# EAGLE design MotorShield (EAGLE 7.5.0)
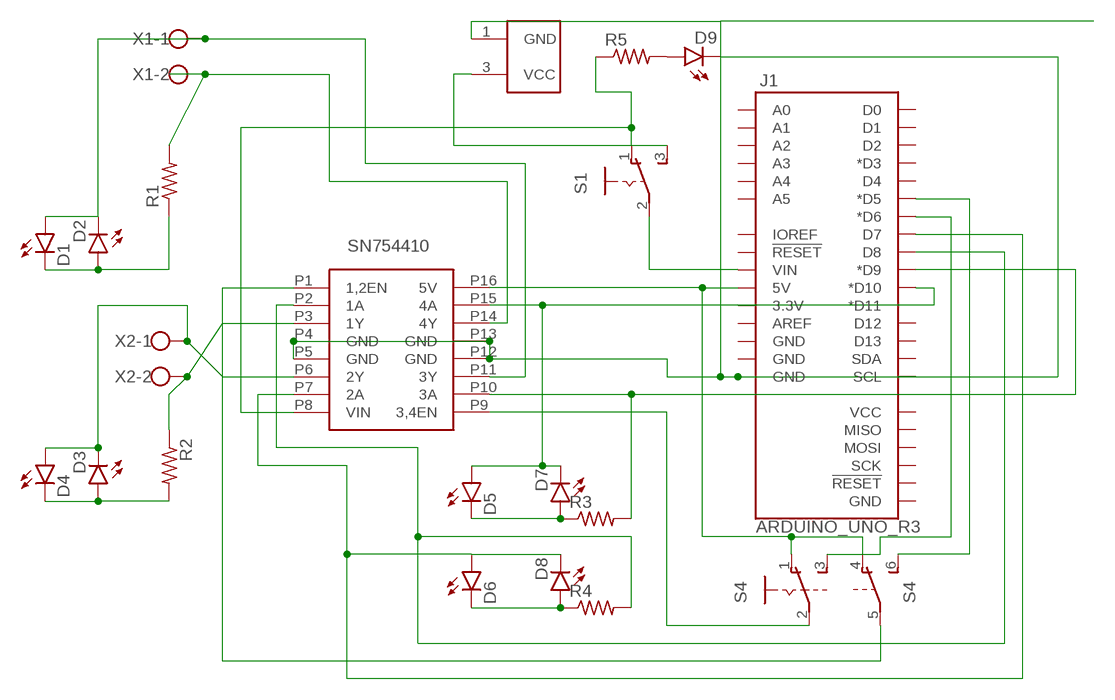
[diagram p0: schematic, sheet 1]

## Parts
D1  LED3MM  [LED3MM]
D2  LED3MM  [LED3MM]
D3  LED3MM  [LED3MM]
D4  LED3MM  [LED3MM]
D5  LED3MM  [LED3MM]
D6  LED3MM  [LED3MM]
D7  LED3MM  [LED3MM]
D8  LED3MM  [LED3MM]
D9  LED3MM  [LED3MM]
J1  ARDUINO_UNO_R3  [ARDUINO_R3]
R1  RESISTOR0204/7  [0204/7]
R2  RESISTOR0204/7  [0204/7]
R3  RESISTOR0204/7  [0204/7]
R4  RESISTOR0204/7  [0204/7]
R5  RESISTOR0204/7  [0204/7]
S1  SLIDE_SWITCH  [SLIDE_SWITCH]
S4  DUAL_SLIDE_SWITCH  [DUAL_SLIDE_SWITCH]
U$1  MOTOR_DRIVERDIP16  [DIP16]
U$2  BARREL_CONNECTOR  [5.5-2.5-BARRELCONNECTOR]
X1  SCREWCONNECTOR  [2PIN-SCREW-TERMINAL]
X2  SCREWCONNECTOR  [2PIN-SCREW-TERMINAL]

## Nets
N$1: R2.1 U$1.P3(1Y) X2.2
N$3: R1.2 U$1.P14(4Y) X1.2
N$4: J1.VIN S1.2(P)
N$5: D6.A D8.K(C) J1.D7 U$1.P7(2A)
N$6: R5.1 S1.1(O) U$1.P8(VIN)
N$8: D5.A D7.K(C) J1.D10(*D10) U$1.P15(4A)
N$9: S4.2(A:P) U$1.P9(3,4EN)
N$10: D3.K(C) D4.A U$1.P6(2Y) X2.1
N$11: J1.D8 R4.2 U$1.P2(1A)
N$12: J1.D9(*D9) R3.2 U$1.P10(3A)
N$13: D9.A R5.2
N$14: J1.D5(*D5) S4.6(B:S)
N$15: S4.5(B:P) U$1.P1(1,2EN)
N$16: J1.D6(*D6) S4.3(A:S)
N$18: D3.A D4.K(C) R2.2
N$19: D5.K(C) D7.A R3.1
N$20: D1.A D2.K(C) U$1.P11(3Y) X1.1
N$21: D1.K(C) D2.A R1.1
N$22: J1.5V S4.1(A:O) S4.4(B:O) U$1.P16(5V)
N$23: D9.K(C) J1.GND@2(GND) U$1.P4(GND) U$1.P5(GND) U$1.P12(GND) U$1.P13(GND) U$2.1(GND)
N$24: D6.K(C) D8.A R4.1
N$26: S1.3(S) U$2.3(VCC)
Unconnected: J1.3.3V J1.A0 J1.A1 J1.A2 J1.A3 J1.A4 J1.A5 J1.AREF J1.D0 J1.D1 J1.D2 J1.D3(*D3) J1.D4 J1.D11(*D11) J1.D12 J1.D13 J1.GND@1(GND) J1.GND@3(GND) J1.GND@4(GND) J1.IOREF J1.MISO J1.MOSI J1.RESET@1(!RESET!) J1.RESET@2(!RESET!) J1.SCK J1.SCL J1.SDA J1.VCC

## Library data of the parts
D1-D9 = ISCTRainingProgram:LED: LEDs Standard schematic elements and footprints for 5mm, 3mm, 1206, and 0603 sized LEDs. 5mm - Spark Fun Electronics SKU : COM-00529 (and others); PROD_ID: DIO-08794
J1 = ISCTRainingProgram:ARDUINO_UNO_R3: Arduino R3 Footprint (w/ SPI header)
R1-R5 = ISCTRainingProgram:RESISTOR: RESISTOR, American symbol
S1 = ISCTRainingProgram:SLIDE_SWITCH: SLIDING SWITCH Distributor Buerklin, 11G810
S4 = ISCTRainingProgram:DUAL_SLIDE_SWITCH: SLIDING SWITCH Siemens, distributor Buerklin, 11G766
U$1 = ISCTRainingProgram:MOTOR_DRIVER: The SN754410 is a quadruple high-current half-H driver designed to provide bidirectional drive currents up to 1 A at voltages from 4.5 V to 36 V. The device is designed to drive inductive loads such as relays, solenoids, DC and bipolar stepping motors, as well as other high-current/high-voltage loads in positive-supply applications.
U$2 = ISCTRainingProgram:BARREL_CONNECTOR: barrel connector for power input
X1 X2 = ISCTRainingProgram:SCREWCONNECTOR: WAGO SCREW CLAMP; MPN: 237-102; OC_FARNELL: unknown; OC_NEWARK: 70K9898

## Board
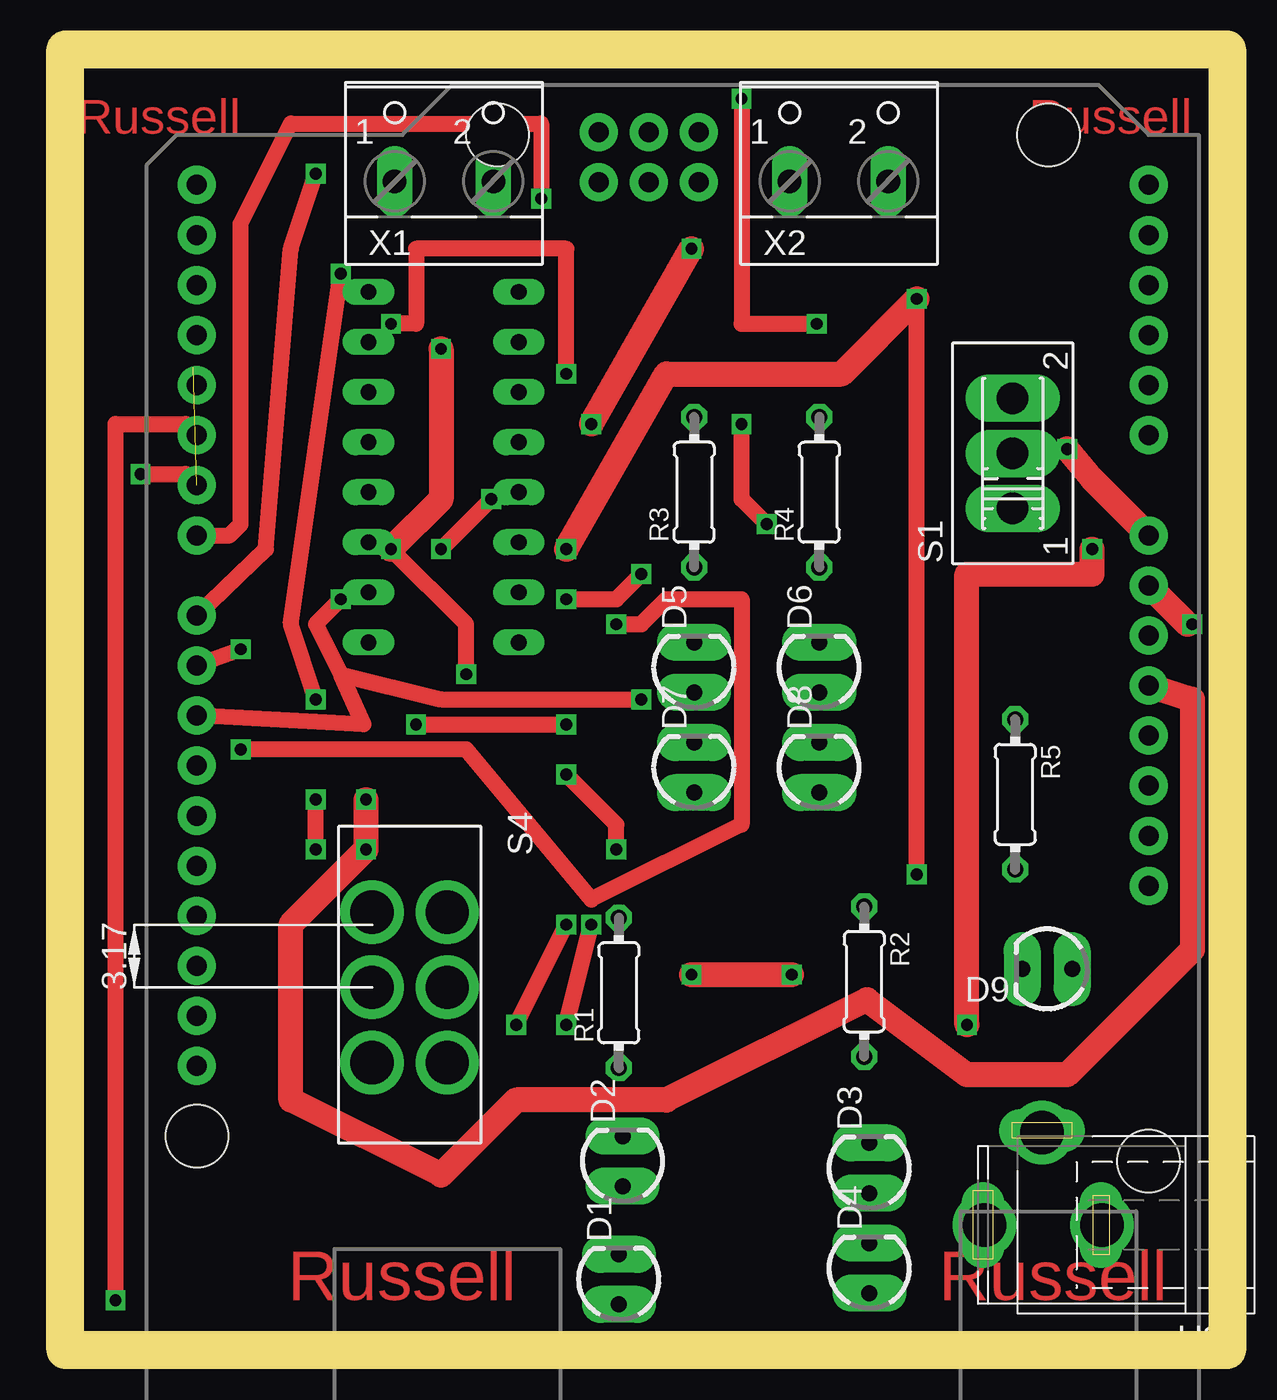
[diagram p1: board, top side]
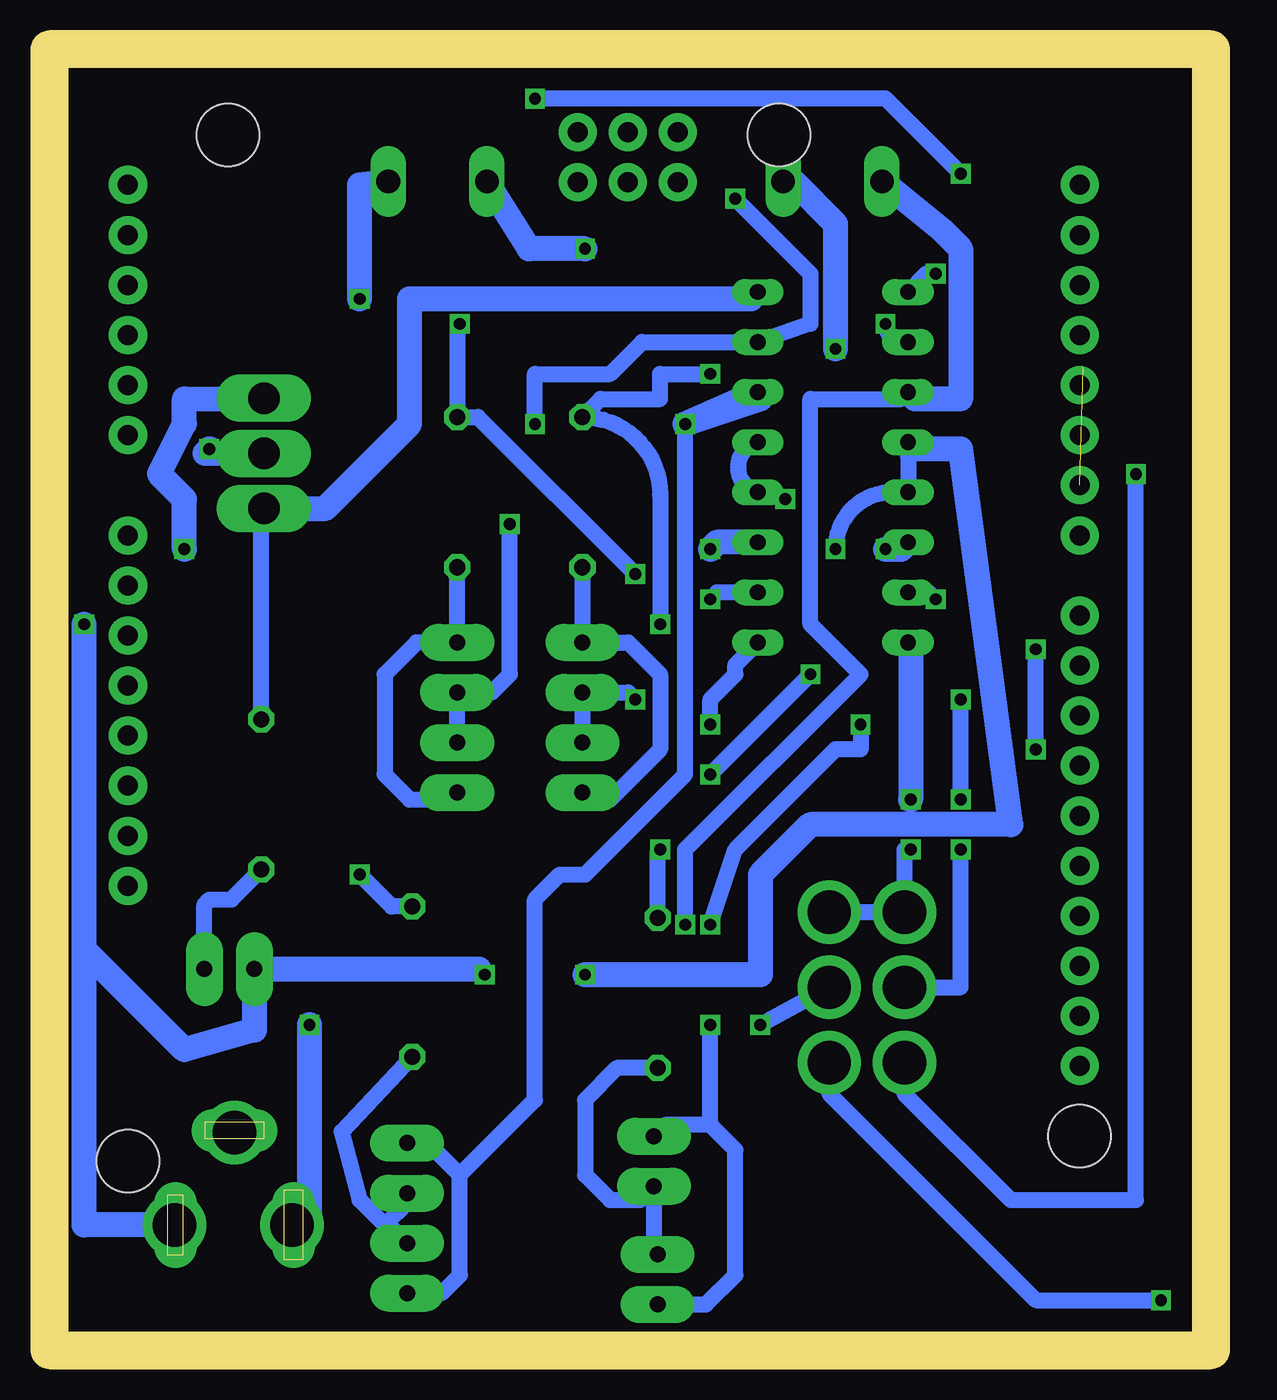
[diagram p2: board, bottom side, seen from below]

Size 58.92 x 66 mm. Coordinates in mm from the lower left corner, seen from the top.
Outline: 0,0 0,66 58.92,66 58.92,0 0,0
Copper layers (1*16): Top 0.035mm / dielectric 1.5mm / Bottom 0.035mm
Design rules "default": minimum track width 10mil, minimum drill 24mil, track to track 8mil, track to pad 8mil, pad to pad 8mil, via to via 8mil, smd to smd 8mil, copper to edge 40mil, drill to drill 8mil, minimum pad ring 10mil, minimum via ring 8mil, stop-mask expansion 4mil, vias tented up to drill 0mil, thermal gap 10mil

### Footprints (pad centres in the part's own frame; a part is rotated, then mirrored left to right if it is on the bottom)
LED3MM = drill 0.813 pad 1.88 long: A -1.27,0; K 1.27,0
ARDUINO_R3 = drill 1.016 pad 1.93: 3.3V 35.56,2.54; 5V 38.1,2.54; A0 50.8,2.54; A1 53.34,2.54; A2 55.88,2.54; A3 58.42,2.54; A4 60.96,2.54; A5 63.5,2.54; AREF 23.876,50.8; D0 63.5,50.8; D1 60.96,50.8; D2 58.42,50.8; D3 55.88,50.8; D4 53.34,50.8; D5 50.8,50.8; D6 48.26,50.8; D7 45.72,50.8; D8 41.656,50.8; D9 39.116,50.8; D10 36.576,50.8; D11 34.036,50.8; D12 31.496,50.8; D13 28.956,50.8; GND@1 40.64,2.54; GND@2 43.18,2.54; GND@3 26.416,50.8; GND@4 66.18,25.35; IOREF 30.48,2.54; MISO 63.64,30.43; MOSI 66.18,27.89; NC 27.94,2.54; RESET@1 33.02,2.54; RESET@2 63.64,25.35; SCK 63.64,27.89; SCL 18.796,50.8; SDA 21.336,50.8; VCC 66.18,30.43; VIN 45.72,2.54 | hole 3.175: 15.24,50.8; 66.04,35.56; 66.04,7.62; 13.97,2.54
0204/7 = drill 0.813 octagon: 1 -3.81,0; 2 3.81,0
SLIDE_SWITCH = drill 1.6 long: 1 -2.794,0; 2 0,0; 3 2.794,0
DUAL_SLIDE_SWITCH = drill 2.2: 1 -3.81,-1.905; 2 0,-1.905; 3 3.81,-1.905; 4 -3.81,1.905; 5 0,1.905; 6 3.81,1.905
DIP16 = drill 0.8 long: P1 -8.89,-3.81; P2 -6.35,-3.81; P3 -3.81,-3.81; P4 -1.27,-3.81; P5 1.27,-3.81; P6 3.81,-3.81; P7 6.35,-3.81; P8 8.89,-3.81; P9 8.89,3.81; P10 6.35,3.81; P11 3.81,3.81; P12 1.27,3.81; P13 -1.27,3.81; P14 -3.81,3.81; P15 -6.35,3.81; P16 -8.89,3.81
5.5-2.5-BARRELCONNECTOR = drill 0.8 pad 2.184 long: 1 -3,0; 2 0,-4.8 | drill 1 pad 2.184 long: 3 3,0 | drill 2.2: P$1 -3.048,0; P$2 2.921,0; P$3 0,-4.699
2PIN-SCREW-TERMINAL = drill 1.194 long: 1 -2.5,-1.27; 2 2.5,-1.27

### Placement (x,y rotation side)
D1  28.07,3.59 90 top
D2  28.26,9.59 90 top
D3  40.77,9.24 90 top
D4  40.77,4.16 90 top
D5  31.88,34.64 90 top
D6  38.23,34.64 90 top
D7  31.88,29.56 90 top
D8  38.23,29.56 90 top
D9  49.79,19.34 180 top
J1  57.47,-4.38 90 top
R1  28.07,18.13 90 top
R2  40.51,18.7 270 top
R3  31.88,43.53 90 top
R4  38.23,43.53 90 top
R5  48.16,28.2 270 top
S1  48.04,45.5 90 top
S4  17.46,18.41 270 top
U$1  19.18,44.8 90 top
U$2  49.53,6.35 180 top
X1  19.2,60.57 0 top
X2  39.23,60.57 0 top

### Tracks (layer width: path | path; a pad name or v marks a point on that pad's centre or on a via)
N$1  (via drill 0.6)
  Top 0.813: v43.18,24.13 v43.18,53.34
  Top 1.27: v25.4,40.64 30.48,49.53 39.37,49.53 v43.18,53.34
  Bottom 0.813: R2.1 41.56,22.51 v43.18,24.13
  Bottom 1.27: U$1.P3 25.05,40.99 v25.4,40.64 | v43.18,53.34 43.18,59.12 X2.2
N$2  (via drill 0.6)
  other vias: 57.15,36.83
N$3  (via drill 0.6)
  Top 0.813: v27.94,25.4 27.94,26.67 v25.4,29.21 | v20.32,34.29 20.32,36.83 v16.51,40.64
  Top 1.27: v19.05,50.8 19.05,43.18 v16.51,40.64
  Bottom 0.813: R1.2 28.07,25.27 v27.94,25.4 | v25.4,29.21 v20.32,34.29
  Bottom 1.27: X1.2 21.2,59.3 19.05,57.15 v19.05,50.8 | v16.51,40.64 15.72,40.64 U$1.P14
N$4  (via drill 0.6)
  Top 1.27: v50.8,45.72 52.07,44.2 J1.VIN
  Bottom 1.27: S1.2 51.02,45.5 v50.8,45.72
N$5  (via drill 0.6)
  Top 0.813: v35.56,41.91 34.29,43.18 v34.29,46.99 | J1.D7 8.32,41.34 8.89,41.91 8.89,57.15 11.43,62.23 24.13,62.23 v24.13,58.42
  Bottom 0.813: D8.K D6.A 36.48,33.37 35.56,34.29 v35.56,41.91 | v34.29,46.99 34.29,49.53 30.48,49.53 28.86,51.15 U$1.P7 20.32,52.07 20.32,54.61 v24.13,58.42
N$6
  Bottom 0.813: R5.1 48.16,42.59 S1.1
  Bottom 1.27: S1.1 44.92,42.71 40.64,46.99 40.64,53.34 23.34,53.34 U$1.P8
N$7  (via drill 0.6)
  other vias: 27.94,25.4
N$8  (via drill 0.6)
  Top 0.813: v13.97,38.1 12.7,36.83 13.97,34.29 | 13.97,34.29 15.11,31.75 J1.D10 | v29.21,33.02 19.05,33.02 13.97,34.29
  Bottom 0.813: U$1.P15 14.32,38.45 v13.97,38.1 | D7.K D5.A 29.56,33.37 v29.21,33.02
N$9  (via drill 0.6)
  Top 0.813: v12.7,25.4 v12.7,27.94 | v12.7,33.02 11.43,36.83 v13.97,54.61
  Bottom 0.813: S4.2 12.7,18.41 v12.7,25.4 | v12.7,27.94 v12.7,33.02 | v13.97,54.61 14.45,54.61 U$1.P9
N$10  (via drill 0.6)
  Top 1.27: v26.67,46.99 v31.75,55.88
  Bottom 0.813: 38.1,8.89 39.37,10.16 | 39.37,10.16 40.42,10.16 D3.K 39.72,10.51 39.37,10.16 | D4.A 39.02,2.89 38.1,3.81 38.1,8.89 | 38.1,8.89 34.29,12.7 34.29,22.86 33.02,24.13 31.75,24.13 26.67,29.21 v26.67,46.99
  Bottom 1.27: 22.86,48.26 v26.67,46.99 U$1.P6 | v31.75,55.88 34.58,55.88 X2.1
N$11  (via drill 0.6)
  Top 0.813: v25.4,38.1 27.94,38.1 v29.21,39.37 | J1.D8 10.16,40.64 11.43,55.88 v12.7,59.69 | v34.29,63.5 34.29,52.07 v38.1,52.07
  Bottom 0.813: v29.21,39.37 37.18,47.34 R4.2 38.23,51.94 v38.1,52.07 | U$1.P2 25.05,38.45 v25.4,38.1 | v12.7,59.69 16.51,63.5 v34.29,63.5
N$12  (via drill 0.6)
  Top 0.813: v25.4,49.53 25.4,55.88 17.78,55.88 17.78,52.07 v16.51,52.07 | v27.94,36.83 29.21,36.83 30.48,38.1 34.29,38.1 34.29,26.67 26.67,22.86 20.32,30.48 v8.89,30.48 | v8.89,35.56 J1.D9
  Bottom 0.813: v25.4,49.53 27.94,49.53 27.94,48.26 30.96,48.26 R3.2 arc90 27.94,43.4 v27.94,36.83 | v16.51,52.07 arc-90 15.59,51.15 U$1.P10 | v8.89,30.48 v8.89,35.56
N$13
  Bottom 0.813: D9.A 51.06,22.6 50.8,22.86 49.69,22.86 R5.2
N$14  (via drill 0.6)
  Top 0.813: v2.54,2.54 2.54,46.99 6.1,46.99 J1.D5
  Bottom 0.813: S4.6 19.37,13.02 8.89,2.54 v2.54,2.54
N$15  (via drill 0.6)
  Top 0.813: v22.86,16.51 v25.4,21.59 | v17.78,31.75 v25.4,31.75
  Bottom 0.813: S4.5 v22.86,16.51 | v25.4,21.59 24.13,25.4 19.05,30.48 17.78,30.48 v17.78,31.75 | v25.4,31.75 25.4,33.02 24.13,34.29 24.13,34.77 U$1.P1
N$16  (via drill 0.6)  (1 unrouted)
  Top 0.813: v3.81,44.45 6.1,44.45 J1.D6
  Bottom 0.813: S4.3 15.55,13.02 10.16,7.62 3.81,7.62 v3.81,44.45
N$18
  Bottom 0.813: R2.2 44.1,11.08 43.18,7.62 41.91,6.35 | 41.91,6.35 41.69,6.35 D4.K | D3.A 40.77,7.49 41.91,6.35
N$19
  Bottom 0.813: R3.1 D5.K 29.56,35.91 27.94,34.29 27.94,30.48 30.48,27.94 31.53,27.94 D7.A
N$20  (via drill 0.6)
  Top 0.813: v25.4,16.51 v26.67,21.59
  Bottom 0.813: D1.A 25.62,2.32 24.13,3.81 24.13,10.16 25.4,11.43 | 25.4,11.43 27.69,11.43 D2.K | 25.4,11.43 v25.4,16.51 | v26.67,21.59 26.67,25.4 17.78,34.29 20.32,36.83 20.32,48.26 15.72,48.26 U$1.P11 15.02,48.26
  Bottom 1.27: X1.1 13.58,56.76 12.7,55.88 12.7,48.26 15.02,48.26
N$21
  Bottom 0.813: R1.1 30.13,14.32 31.75,12.7 31.75,8.89 30.48,7.62 28.96,7.62 D2.A 28.26,5.05 D1.K
N$22  (via drill 0.6)
  Top 1.27: v15.24,27.94 v15.24,25.4 11.43,21.59 11.43,12.7 19.05,8.89 22.86,12.7 30.48,12.7 40.64,17.78 45.72,13.97 50.8,13.97 57.15,20.32 57.15,33.02 J1.5V
  Bottom 0.813: U$1.P16 15.24,35.91 | v15.24,25.4 15.55,25.4 S4.1 19.05,22.22 19.05,22.86 19.37,22.86 S4.4
  Bottom 1.27: 15.24,35.91 v15.24,27.94
N$23  (via drill 0.6)
  Top 0.813: v57.15,36.83 56.9,36.83 | v19.05,40.64 v21.59,43.18
  Top 1.27: v36.83,19.05 v31.75,19.05 | 56.9,36.83 J1.GND@2
  Bottom 0.813: 37.12,19.34 v36.83,19.05 | 15.02,45.72 15.37,45.37 U$1.P13 16.16,43.53 arc-90 v19.05,40.64 | v21.59,43.18 U$1.P4 arc152 U$1.P5
  Bottom 1.27: 37.12,19.34 D9.K 48.52,16.25 52.07,15.24 57.15,20.32 | 57.15,20.32 v57.15,36.83 | U$1.P12 15.02,45.72 12.7,45.72 10.16,26.67 20.32,26.67 22.86,24.13 22.86,19.05 v31.75,19.05 | U$2.1 57.15,6.35 57.15,20.32
N$24
  Bottom 0.813: D8.A 38.58,27.94 40.64,27.94 41.91,29.21 41.91,34.29 40.29,35.91 D6.K R4.1
N$25  (via drill 0.6)
  other vias: 31.75,19.05
N$26  (via drill 0.6)
  Top 1.27: v45.72,16.51 45.72,39.37 52.07,39.37 v52.07,40.64
  Bottom 1.27: U$2.3 45.72,6.35 v45.72,16.51 | v52.07,40.64 52.07,43.18 53.34,44.45 52.07,46.99 52.07,48.26 S1.3
N$27  (via drill 0.6)
  other vias: 43.18,24.13
N$28  (via drill 0.6)
  other vias: 43.18,53.34
N$29  (via drill 0.6)
  other vias: 25.4,40.64
N$30  (via drill 0.6)
  other vias: 13.97,38.1
N$31  (via drill 0.6)
  other vias: 29.21,33.02
N$32  (via drill 0.6)
  other vias: 25.4,38.1
N$33  (via drill 0.6)
  other vias: 25.4,31.75
N$34  (via drill 0.6)
  other vias: 15.24,25.4
N$35  (via drill 0.6)
  other vias: 12.7,27.94
N$36  (via drill 0.6)
  other vias: 13.97,54.61
N$37  (via drill 0.6)
  other vias: 34.29,46.99
N$38  (via drill 0.6)
  other vias: 16.51,52.07
N$39  (via drill 0.6)
  other vias: 22.86,16.51

### Text on the board
Top: Russell | Russell | Russell | Russell